# Altium schematic sheet sch_widya-robotic_M. Maulana Faik_soal_1.schdoc
size 212 x 261 mm
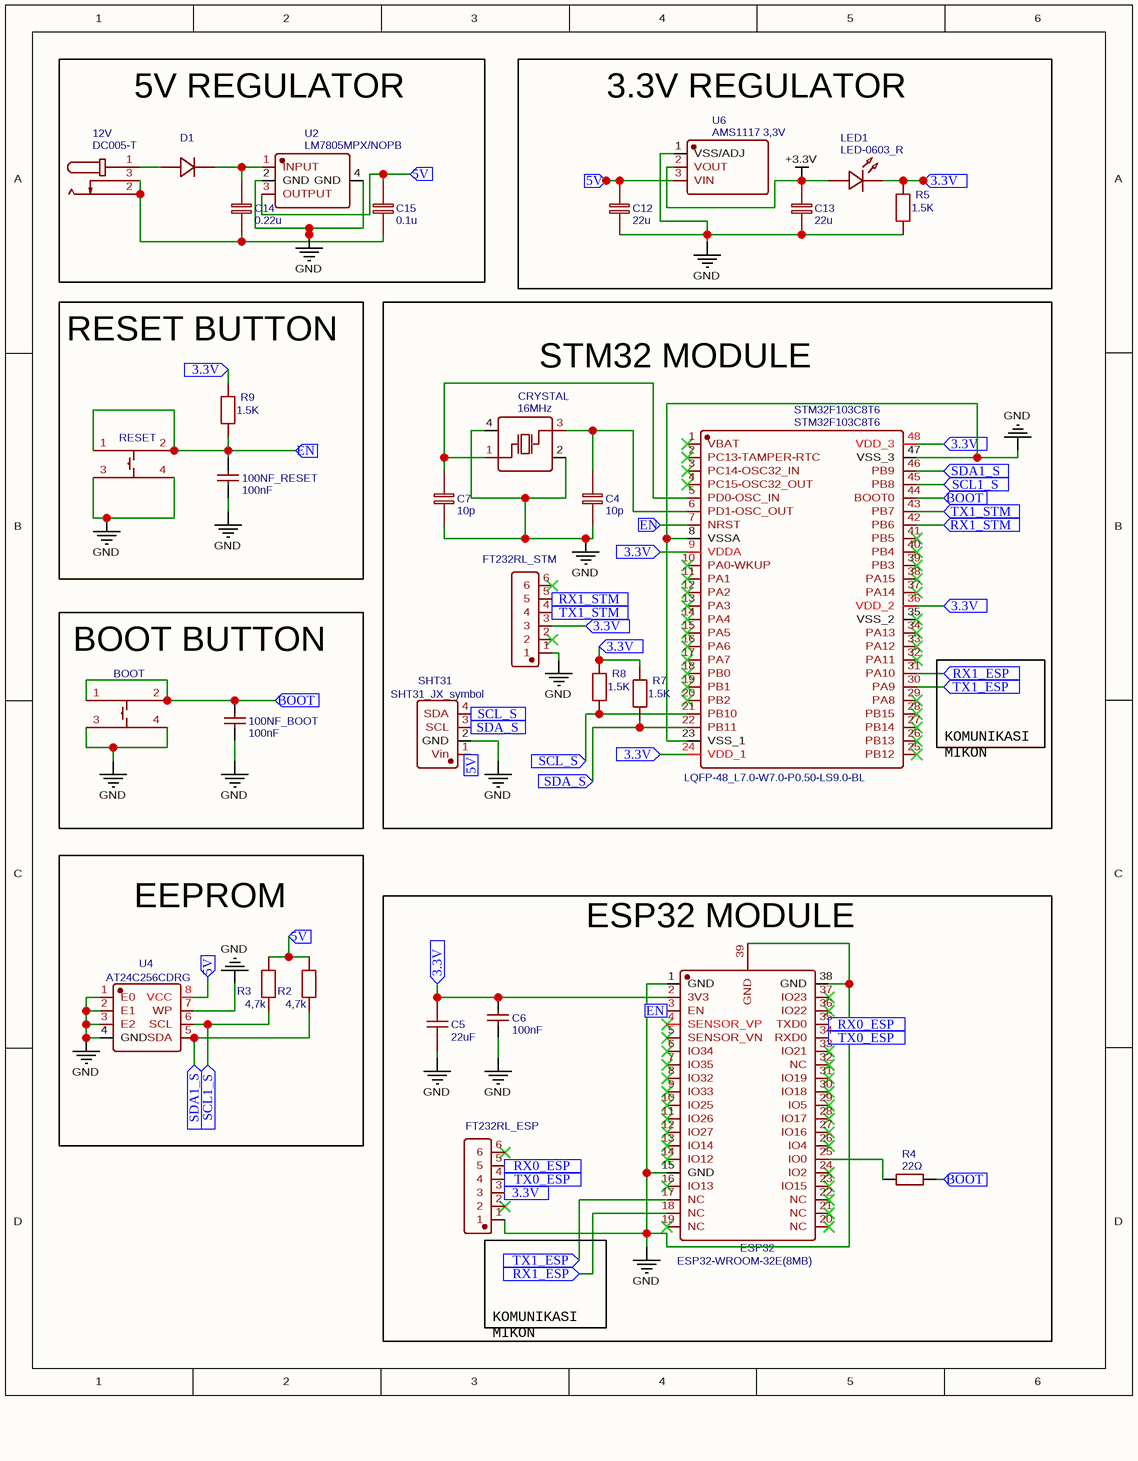
[diagram p0: sch_widya-robotic_M. Maulana Faik_soal_1.schdoc]

## Parts
12V  DC005-T  [DC-IN-TH_DC005-T]
100NF_BOOT  100nF  [C0402]
100NF_RESET  100nF  [C0402]
BOOT  TS-1002S-04326C  [KEY-SMD_4P-L6.0-W6.0-P4.50-LS9.0]  (value not drawn)
C4  10p  [C0402]
C5  22uF  [C0805]
C6  100nF  [C0402]
C7  10p  [C0402]
C12  22u  [C0805]
C13  22u  [C0805]
C14  0.22u  [C0805]
C15  0.1u  [C0805]
CRYSTAL  16MHz  [OSC-SMD_4P-L3.2-W2.5-BL]
D1  1N4007_C2909831  [SMA_L4.3-W2.6-LS5.1-RD]  (value not drawn)
ESP32  ESP32-WROOM-32E(8MB)  [WIFI-SMD_ESP32-WROOM-32E]
FT232RL_ESP  Header-Female-2.54_1x6  [HDR-TH_6P-P2.54-V-F]  (value not drawn)
FT232RL_STM  Header-Female-2.54_1x6  [HDR-TH_6P-P2.54-V-F]  (value not drawn)
LED1  LED-0603_R  [LED0603_RED]
R2  4,7k  [R0402]
R3  4,7k  [R0402]
R4  22Ω  [R0402]
R5  1.5K  [R0402]
R7  1.5K  [R0402]
R8  1.5K  [R0402]
R9  1.5K  [R0402]
RESET  TS-1002S-04326C  [KEY-SMD_4P-L6.0-W6.0-P4.50-LS9.0]  (value not drawn)
SHT31  SHT31_JX_symbol  [SHT31_FP_JX]
STM32F103C8T6  STM32F103C8T6  [LQFP-48_L7.0-W7.0-P0.50-LS9.0-BL]
U2  LM7805MPX/NOPB  [SOT-223-4_L6.5-W3.5-P2.30-LS7.0-BR]
U4  AT24C256CDRG  [SOP-8_L4.9-W3.9-P1.27-LS6.0-BL]
U6  AMS1117 3,3V  [TO-252-2_L6.5-W6.1-P4.58-LS10.0-BL]

## Blocks framed on the sheet
5V REGULATOR: 12V C14 C15 D1 U2
3.3V REGULATOR: C12 C13 LED1 R5 U6
RESET BUTTON: 100NF_RESET R9 RESET
STM32 MODULE: C4 C7 CRYSTAL FT232RL_STM R7 R8 SHT31 STM32F103C8T6
BOOT BUTTON: 100NF_BOOT BOOT
EEPROM: R2 R3 U4
ESP32 MODULE: C5 C6 ESP32 FT232RL_ESP R4

## Ports
3.3V (in), 5V (in), BOOT (in), EN (in), RX0_ESP (in), RX1_ESP (in), RX1_STM (in), SCL1_S (in), SCL_S (in), SDA1_S (in), SDA_S (in), TX0_ESP (in), TX1_ESP (in), TX1_STM (in)

## Nets
+3.3V: C13.2 LED1.1 U6.2(VOUT)
GND: 12V.2 12V.3 100NF_BOOT.1 100NF_RESET.1 BOOT.3 BOOT.4 C4.1 C5.1 C6.1 C7.1 C12.1 C13.1 C14.1 C15.1 CRYSTAL.2(GND) CRYSTAL.4(GND) ESP32.1(GND) ESP32.15(GND) ESP32.38(GND) ESP32.39(GND) FT232RL_ESP.1 FT232RL_STM.1 R5.1 RESET.3 RESET.4 SHT31.2(GND) STM32F103C8T6.8(VSSA) STM32F103C8T6.23(VSS_1) STM32F103C8T6.47(VSS_3) U2.2(GND) U2.4(GND) U4.1(E0) U4.2(E1) U4.3(E2) U4.4(GND) U4.7(WP) U6.1(VSS/ADJ)
3.3V: C5.2 C6.2 ESP32.2(3V3) FT232RL_ESP.3 FT232RL_STM.3 LED1.2 R5.2 R7.2 R8.2 R9.2 STM32F103C8T6.9(VDDA) STM32F103C8T6.24(VDD_1) STM32F103C8T6.36(VDD_2) STM32F103C8T6.48(VDD_3) ; port 3.3V
5V: C12.2 C15.2 R2.2 R3.2 SHT31.1(Vin) U2.3(OUTPUT) U4.8(VCC) U6.3(VIN) ; port 5V
BOOT: 100NF_BOOT.2 BOOT.1 BOOT.2 R4.2 STM32F103C8T6.44(BOOT0) ; port BOOT
EN: 100NF_RESET.2 ESP32.3(EN) R9.1 RESET.1 RESET.2 STM32F103C8T6.7(NRST) ; port EN
RX0_ESP: ESP32.35(TXD0) FT232RL_ESP.5 ; port RX0_ESP
RX1_ESP: ESP32.18(NC) STM32F103C8T6.31(PA10) ; port RX1_ESP
RX1_STM: FT232RL_STM.5 STM32F103C8T6.42(PB6) ; port RX1_STM
SCL1_S: R3.1 STM32F103C8T6.45(PB8) U4.6(SCL) ; port SCL1_S
SCL_S: R8.1 SHT31.4(SDA) STM32F103C8T6.21(PB10) ; port SCL_S
SDA1_S: R2.1 STM32F103C8T6.46(PB9) U4.5(SDA) ; port SDA1_S
SDA_S: R7.1 SHT31.3(SCL) STM32F103C8T6.22(PB11) ; port SDA_S
TX0_ESP: ESP32.34(RXD0) FT232RL_ESP.4 ; port TX0_ESP
TX1_ESP: ESP32.17(NC) STM32F103C8T6.30(PA9) ; port TX1_ESP
TX1_STM: FT232RL_STM.4 STM32F103C8T6.43(PB7) ; port TX1_STM
Net12V_1: 12V.1 D1.2(A)
NetC4_2: C4.2 CRYSTAL.3(OSC2) STM32F103C8T6.6(PD1-OSC_OUT)
NetC7_2: C7.2 CRYSTAL.1(OSC1) STM32F103C8T6.5(PD0-OSC_IN)
NetC14_2: C14.2 D1.1(K) U2.1(INPUT)
NetESP32_25: ESP32.25(IO0) R4.1

Not connected (* = marked no-connect by the designer): ESP32 4(SENSOR_VP)* 5(SENSOR_VN)* 6(IO34)* 7(IO35)* 8(IO32)* 9(IO33)* 10(IO25)* 11(IO26)* 12(IO27)* 13(IO14)* 14(IO12)* 16(IO13)* 19(NC)* 20(NC)* 21(NC)* 22(NC)* 23(IO15)* 24(IO2)* 26(IO4)* 27(IO16)* 28(IO17)* 29(IO5)* 30(IO18)* 31(IO19)* 32(NC)* 33(IO21)* 36(IO22)* 37(IO23)*; FT232RL_ESP 2* 6*; FT232RL_STM 2* 6*; STM32F103C8T6 1(VBAT)* 2(PC13-TAMPER-RTC)* 3(PC14-OSC32_IN)* 4(PC15-OSC32_OUT)* 10(PA0-WKUP)* 11(PA1)* 12(PA2)* 13(PA3)* 14(PA4)* 15(PA5)* 16(PA6)* 17(PA7)* 18(PB0)* 19(PB1)* 20(PB2)* 25(PB12)* 26(PB13)* 27(PB14)* 28(PB15)* 29(PA8)* 32(PA11)* 33(PA12)* 34(PA13)* 35(VSS_2)* 37(PA14)* 38(PA15)* 39(PB3)* 40(PB4)* 41(PB5)*

## Notes on the sheet
- (near STM32F103C8T6) KOMUNIKASI
  MIKON
- KOMUNIKASI
  MIKON
- (in symbol STM32F103C8T6) LQFP-48_L7.0-W7.0-P0.50-LS9.0-BL

## Library data of the parts
12V = DC005-T: Manufacturer: SHOU HAN(首韩); Contributor: LCSC; Package Display: No; Supplier: LCSC; Supplier Part: C431532; Manufacturer Part: DC005-T; JLCPCB Part Class: Extended Part; spicePre: D; spiceSymbolName: DC005-T
100NF_BOOT 100NF_RESET C6 = 100nF: Manufacturer: SAMSUNG(三星); Manufacturer Part: CL05A104KA5NNNC; nameAlias: Capacitance; Supplier: LCSC; Supplier Part: C100072; JLCPCB Part Class: Extended Part; spicePre: C; spiceSymbolName: CL05A104KA5NNNC
BOOT RESET = TS-1002S-04326C: Manufacturer: XUNPU(讯普); Contributor: LCSC; Package Display: No; Supplier: LCSC; Supplier Part: C455108; Manufacturer Part: TS-1002S-04326C; JLCPCB Part Class: Extended Part; spicePre: S; spiceSymbolName: TS-1002S-04326C
C4 C7 = 10p: nameAlias: Value(F); Contributor: LCEDA_Lib; spicePre: C; spiceSymbolName: C_0603_EU
C5 = 22uF: Manufacturer: SAMSUNG(三星); Manufacturer Part: CL21A226KPCLRNC; nameAlias: Capacitance; Contributor: LCSC; Supplier: LCSC; Supplier Part: C318688; JLCPCB Part Class: Extended Part; spicePre: C; spiceSymbolName: CL21A226KPCLRNC
C12 C13 = 22u: nameAlias: Value(F); Contributor: LCEDA_Lib; spicePre: C; spiceSymbolName: C_0603_EU
C14 = 0.22u: nameAlias: Value(F); Contributor: LCEDA_Lib; spicePre: C; spiceSymbolName: C_0603_EU
C15 = 0.1u: nameAlias: Value(F); Contributor: LCEDA_Lib; spicePre: C; spiceSymbolName: C_0603_EU
CRYSTAL = 16MHz: Manufacturer: YXC; Manufacturer Part: X322516MLB4SI; nameAlias: Frequency; Supplier: LCSC; Supplier Part: C13738; JLCPCB Part Class: Basic Part; spicePre: X; spiceSymbolName: X322516MLB4SI
D1 = 1N4007_C2909831: Manufacturer: YONGYUTAI(永裕泰); Manufacturer Part: 1N4007; Contributor: LCSC; Package Display: No; Supplier: LCSC; Supplier Part: C2909831; JLCPCB Part Class: Extended Part; spicePre: D; spiceSymbolName: 1N4007_C2909831
ESP32 = ESP32-WROOM-32E(8MB): Manufacturer: ESPRESSIF(乐鑫); Manufacturer Part: ESP32-WROOM-32E-N8; Contributor: LCSC; Package Display: No; Supplier: LCSC; Supplier Part: C701342; JLCPCB Part Class: Extended Part; spicePre: U; spiceSymbolName: ESP32-WROOM-32E(8MB)
FT232RL_ESP FT232RL_STM = Header-Female-2.54_1x6: Manufacturer: BOOMELE(博穆精密); Manufacturer Part: 2.54-1*6P母; Package Display: No; Supplier: LCSC; Supplier Part: C40877; JLCPCB Part Class: Extended Part; spicePre: P; spiceSymbolName: Header-Female-2.54_1x6
LED1 = LED-0603_R: Manufacturer: EVERLIGHT(台湾亿光); Manufacturer Part: 19-217/R6C-AL1M2VY/3T; Contributor: LCEDA_01; Supplier Part: C72044; Supplier: LCSC; spicePre: L; spiceSymbolName: LED-0603_R
R2 R3 = 4,7k: nameAlias: Value(Ω); Contributor: LCEDA_Lib; spicePre: R; spiceSymbolName: R_0603_EU
R4 = 22Ω: Manufacturer: UNI-ROYAL(厚声); Manufacturer Part: 0402WGF220JTCE; nameAlias: Resistance; Resistance (Ohms): 22; Supplier: LCSC; Supplier Part: C25092; JLCPCB Part Class: Basic Part; spicePre: R; spiceSymbolName: 0402WGF220JTCE
R5 R7-R9 = 1.5K: nameAlias: Value(Ω); Contributor: LCEDA_Lib; spicePre: R; spiceSymbolName: R_0603_EU
SHT31 = SHT31_JX_symbol: Contributor: Dan Junxian; Package Display: No; spicePre: U; spiceSymbolName: SHT31_JX_symbol
STM32F103C8T6 = STM32F103C8T6: Manufacturer: ST(意法半导体); Package Display: Yes; timeStamp: 1455028086; Supplier: LCSC; Manufacturer Part: STM32F103C8T6; Supplier Part: C8734; JLCPCB Part Class: Extended Part; spicePre: U; spiceSymbolName: STM32F103C8T6
U2 = LM7805MPX/NOPB: Manufacturer: null; Contributor: LCSC; Supplier: LCSC; Supplier Part: C2848241; Manufacturer Part: LM7805MPX/NOPB; JLCPCB Part Class: Extended Part; spicePre: U; spiceSymbolName: LM7805MPX/NOPB
U4 = AT24C256CDRG: Manufacturer: HGC(深圳汉芯); Contributor: lcsc; Package Display: No; Supplier: LCSC; Supplier Part: C19723712; Manufacturer Part: AT24C256CDRG; JLCPCB Part Class: Extended Part; spicePre: U; spiceSymbolName: AT24C256CDRG
U6 = AMS1117 3,3V: Manufacturer: WPMtek(维攀); Manufacturer Part: AMS1117-ADJ; Contributor: lcsc; Package Display: No; Supplier: LCSC; Supplier Part: C3009901; JLCPCB Part Class: Extended Part; spicePre: U; spiceSymbolName: AMS1117-ADJ_C3009901